# Altium schematic sheet Sensors.SchDoc: Наименование
size 209 x 297 mm; ApprovedBy: Утвердил; CheckedBy: Проверил; Author: Разработал; CompanyName: Организация; DrawnBy: Н.Контр; Engineer: Т.Контр; SheetNumber: 5; SheetTotal: 5; PageSetup: Record=PageOptions|CenterHorizontal=True|CenterVertical=True|PrintScale=0.94|XCorrection=1.00|YCorrection=1.00|PrintKind=1|BorderSize=5000000|LeftOffset=0|BottomOffset=0|Orientation=1|PaperLength=1000|PaperWidth=1000|Scale=100|PaperSource=7|PrintQuality=-4|MediaType=1|DitherType=10|PaperKind=A4|PrintScaleMode=1; DecimalNumber: Децимальный номер; HeadOfSector: Нач. сектора; MainDevice: Перв.примен.; Name: Наименование; DocumentName: Sheet1.SCHDOC
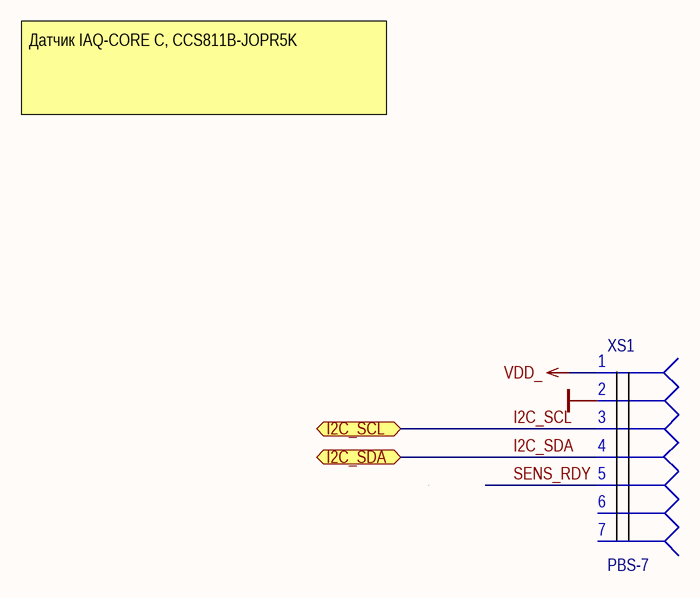
[diagram p0: Sensors.SchDoc]

## Parts
XS1  PBS-7  [PBS-7]

## Ports
I2C_SCL (bidir), I2C_SDA (bidir)

## Nets
GND: XS1.2
VDD_: XS1.1
I2C_SCL: XS1.3 ; port I2C_SCL
I2C_SDA: XS1.4 ; port I2C_SDA
SENS_RDY: XS1.5

Not connected (* = marked no-connect by the designer): XS1 6 7

## Notes on the sheet
- Датчик IAQ-CORE C, CCS811B-JOPR5K
- Подп. и дата
- Инв.№ дубл.
- Взам.инв.№
- Подп.и дата
- Инв.№ подл.
- Изм.
- Лист
- № докум.
- Подп.
- Дата
- Формат  A4